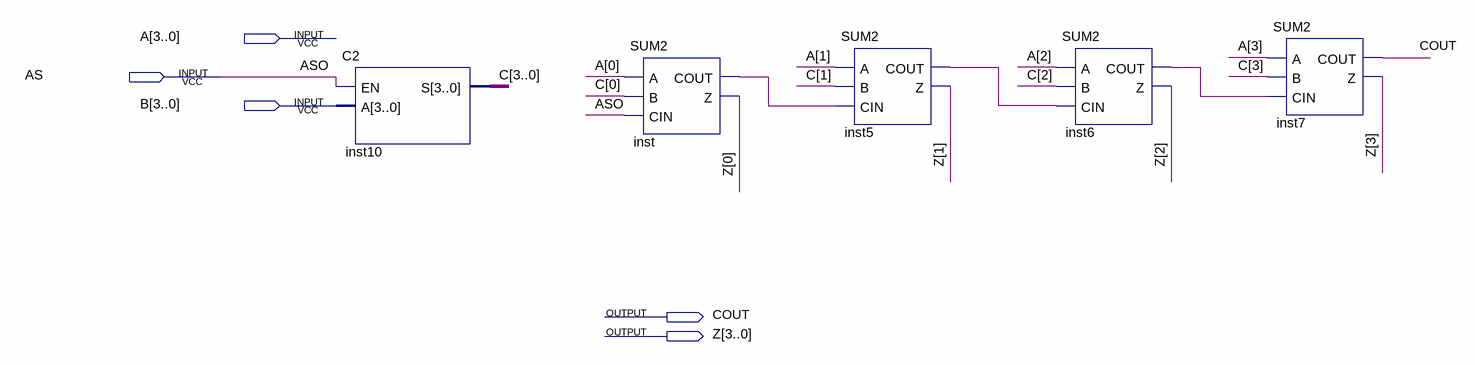
[diagram p0: schematic sheet]
// Quartus schematic ALU.bdf as structural Verilog: 5 symbols, 5 pins
module ALU (
  input  [3:0] A,
  input  AS,
  input  [3:0] B,
  output COUT,
  output [3:0] Z
);

  wire inst5_cout, inst6_cout, inst_cout;
  wire [3:0] C;

  C2 inst10 (.EN(AS), .A(B), .S(C));
  SUM2 inst (.A(A[0]), .B(C[0]), .CIN(AS), .COUT(inst_cout), .Z(Z[0]));
  SUM2 inst5 (.A(A[1]), .B(C[1]), .CIN(inst_cout), .COUT(inst5_cout), .Z(Z[1]));
  SUM2 inst6 (.A(A[2]), .B(C[2]), .CIN(inst5_cout), .COUT(inst6_cout), .Z(Z[2]));
  SUM2 inst7 (.A(A[3]), .B(C[3]), .CIN(inst6_cout), .COUT(COUT), .Z(Z[3]));

  // Other names for the same wires on the sheet: ASO = AS
endmodule
